# EAGLE design sensorstation_ok_pwr (EAGLE 6.2)
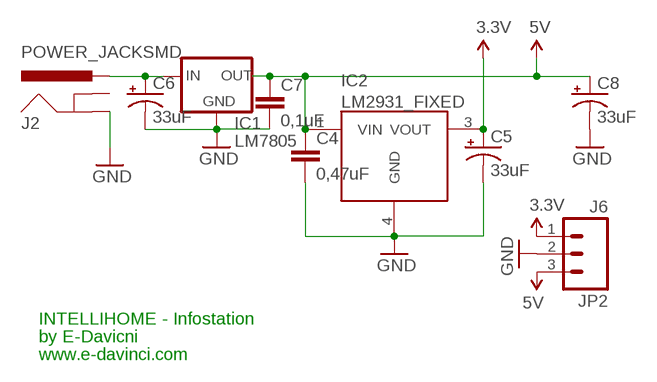
[diagram p0: schematic, sheet 1]

## Parts
C4  0,47uF  CAPKIT  [CAP-PTH-SMALL-KIT]
C5  33uF  CAP_POLPTH2  [CPOL-RADIAL-10UF-25V]
C6  33uF  CAP_POLPTH2  [CPOL-RADIAL-10UF-25V]
C7  0,1uF  CAPKIT  [CAP-PTH-SMALL-KIT]
C8  33uF  CAP_POLPTH2  [CPOL-RADIAL-10UF-25V]
IC1  LM7805  V_REG_78XX-TO-220  [TO-220-ALT]
IC2  LM2931_FIXED  [DPAK]
J2  POWER_JACKSMD  [POWER_JACK_SMD]
JP2  J6  M03PTH  [1X03]

## Nets
3.3V: C5.1(+) IC2.3(VOUT) JP2.1
5V: C4.1 C7.1 C8.1(+) IC1.OUT IC2.1(VIN) JP2.3
GND: C4.2 C5.2(-) C6.2(-) C7.2 C8.2(-) IC1.GND IC2.4(GND) J2.P$4(GND) JP2.2
N$2: C6.1(+) IC1.IN J2.VIN0(PWR)
Unconnected: J2.GND(GNDBREAK)

## Notes on the sheet
- INTELLIHOME - Infostation
- by E-Davicni
- www.e-davinci.com

## Library data of the parts
C4 C7 = SparkFun:CAP: Capacitor Standard 0603 ceramic capacitor, and 0.1" leaded capacitor.
C5 C6 C8 = SparkFun:CAP_POL: Capacitor Polarized These are standard SMD and PTH capacitors. Normally 10uF, 47uF, and 100uF in electrolytic and tantalum varieties. Always verify the external diameter of the through hole cap, it varies with capacity, voltage, and manufacturer. The EIA devices should be standard.
IC1 = SparkFun:V_REG_78XX: Voltage Regulator Standard 7805 5V regulator. IGO (Input Ground Output). Spark Fun Electronics SKU : COM-00107
IC2 = SparkFun:LM2931_FIXED
J2 = SparkFun:POWER_JACK: Power Jack This is the standard 5.5mm barrel jack for power. The PTH is the most common, proven, reliable, footprint. All others are experimental. The Slot footprint only works if the mill layer is transmitted to the PCB fab house so be warned. Spark Fun Electronics SKU : PRT-00119. Mating wall wart : TOL-00298 (and others)
JP2 = SparkFun:M03: Header 3 Standard 3-pin 0.1" header. Use with straight break away headers (SKU : PRT-00116), right angle break away headers (PRT-00553), swiss pins (PRT-00743), machine pins (PRT-00117), and female headers (PRT-00115). Molex polarized connector foot print use with SKU : PRT-08232 with associated crimp pins and housings.

## Board
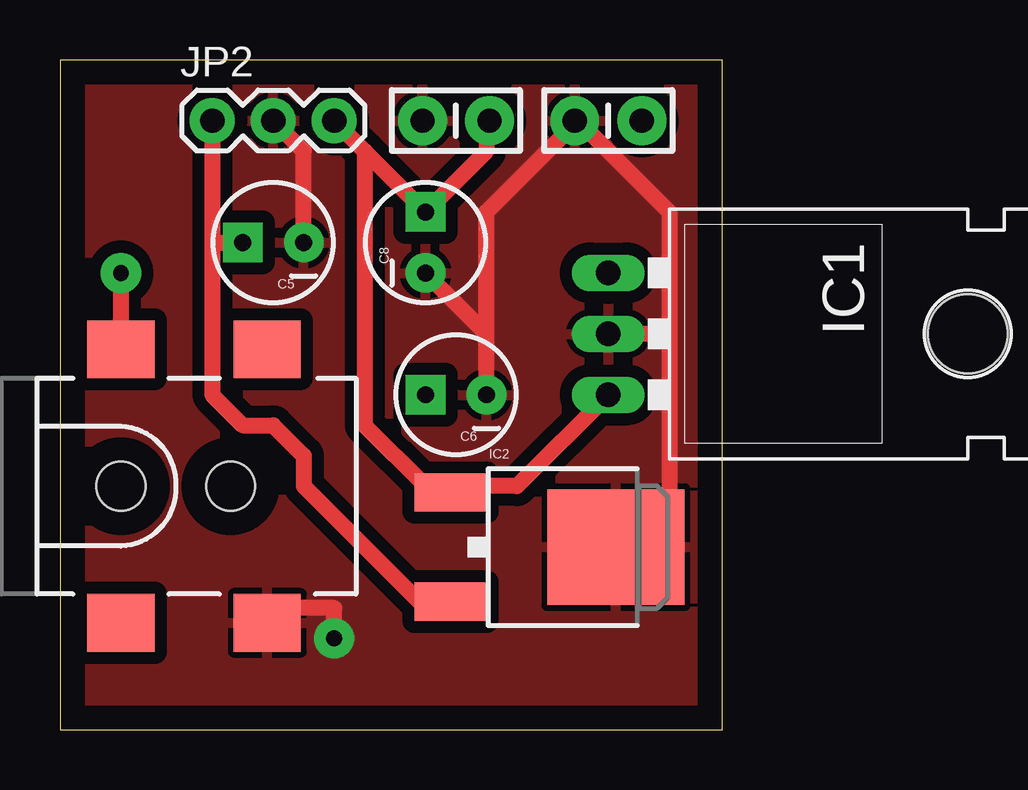
[diagram p1: board, top side]
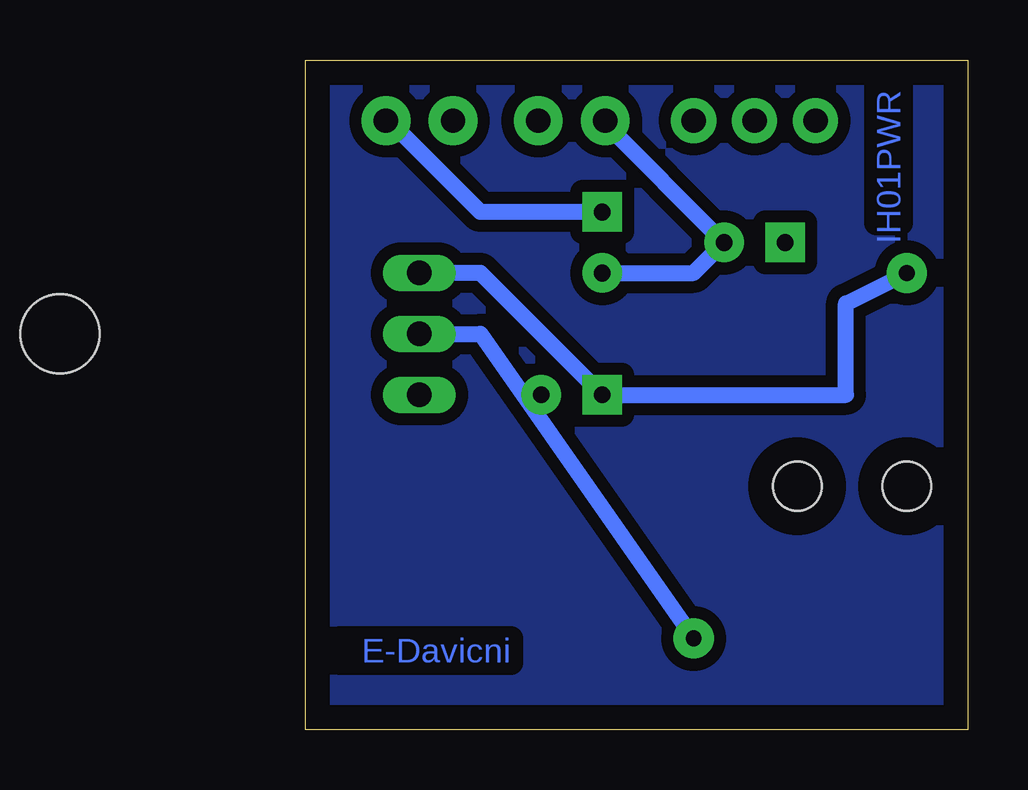
[diagram p2: board, bottom side, seen from below]

Size 27.61 x 27.93 mm. Coordinates in mm from the lower left corner, seen from the top.
Outline: 0,0 27.61,0 27.61,27.93 0,27.93 0,0
Copper layers (1*16): Top 0.035mm / dielectric 1.5mm / Bottom 0.035mm
Design rules: minimum track width 26mil, minimum drill 26mil, track to track 20mil, track to pad 20mil, pad to pad 20mil, via to via 20mil, smd to smd 8mil, copper to edge 40mil, drill to drill 8mil, minimum pad ring 10mil, minimum via ring 20mil, stop-mask expansion 4mil, vias tented up to drill 0mil, thermal gap 10mil

### Footprints (pad centres in the part's own frame; a part is rotated, then mirrored left to right if it is on the bottom)
CAP-PTH-SMALL-KIT = drill 1.016 pad 2.032: 1 -1.397,0; 2 1.397,0
CPOL-RADIAL-10UF-25V = drill 0.7 pad 1.651 square: 1 1.27,0 | drill 0.7 pad 1.651: 2 -1.27,0
TO-220-ALT = drill 1.016 long: GND 0,-3.81; IN -2.54,-3.81; OUT 2.54,-3.81 | hole 3.302: 0,11.176
DPAK = smd 1.6 x 3: 1 -2.28,-5.31; 3 2.28,-5.31 | smd 4.826 x 5.715: 4 0,1.588
POWER_JACK_SMD = smd 2.8 x 2.4: GND 0,-5.7; P$4 6.1,-5.7; VIN0 0,5.7; VIN1 6.1,5.7 | hole 2.032: 0,0; 4.572,0
1X03 = drill 1.016 pad 1.88: 1 0,0; 2 2.54,0; 3 5.08,0

### Placement (x,y rotation side)
C4  16.51,25.4 180 top
C5  8.89,20.32 180 top
C6  16.51,13.97 180 top
C7  22.86,25.4 180 top
C8  15.24,20.32 90 top
IC1  26.67,16.51 270 top
IC2  21.59,7.62 270 top
J2  2.54,10.16 0 top
JP2  6.35,25.4 0 top

### Tracks (layer width: path | path; a pad name or v marks a point on that pad's centre or on a via)
3.3V
  Top 0.66: JP2.1 6.35,20.32 | 6.35,20.32 6.35,13.97 7.62,12.7 8.89,12.7 10.16,11.43 10.16,10.16 15.24,5.08 IC2.3 | 6.35,20.32 C5.1
5V
  Top 0.66: IC1.OUT 19.05,10.16 16.51,10.16 IC2.1 15.24,10.16 12.7,12.7 12.7,24.13 | C4.1 17.78,25.4 17.78,24.13 C8.1 12.7,24.13 | 12.7,24.13 JP2.3
  Bottom 0.66: C8.1 20.32,21.59 24.13,25.4 C7.1
GND  (via drill 0.66)
  Top 0.66: v11.43,3.81 11.43,5.08 8.89,5.08 J2.P$4 | 17.78,16.51 C8.2 | C6.2 17.78,16.51 | JP2.2 10.16,24.13 C5.2 | 21.59,25.4 17.78,21.59 17.78,16.51 | 25.4,16.51 25.4,21.59 21.59,25.4 | 25.4,16.51 25.4,8.89 24.13,7.62 IC2.4 | 21.59,25.4 C7.2 | 25.4,16.51 IC1.GND
  Bottom 0.66: v11.43,3.81 20.32,16.51 IC1.GND | C8.2 11.43,19.05 C5.2 15.24,25.4 C4.2
  pour Top: 0,27.94 27.94,27.94 27.94,0 0,0
N$1
  pour Bottom: 0,27.94 27.94,27.94 27.94,0 0,0
N$2  (via drill 0.66)
  Top 0.66: v2.54,19.05 J2.VIN0 2.54,15.24
  Bottom 0.66: v2.54,19.05 5.08,17.78 5.08,13.97 C6.1 20.32,19.05 IC1.IN

### Text on the board
Bottom: IH01PWR | E-Davicni